# Altium schematic sheet Connectors.SchDoc: Extension connectors
size A4; DocumentNumber: MB1136; Revision: C.3; SheetNumber: 5; SheetTotal: 5; Project: NUCLEO-XXXXRX
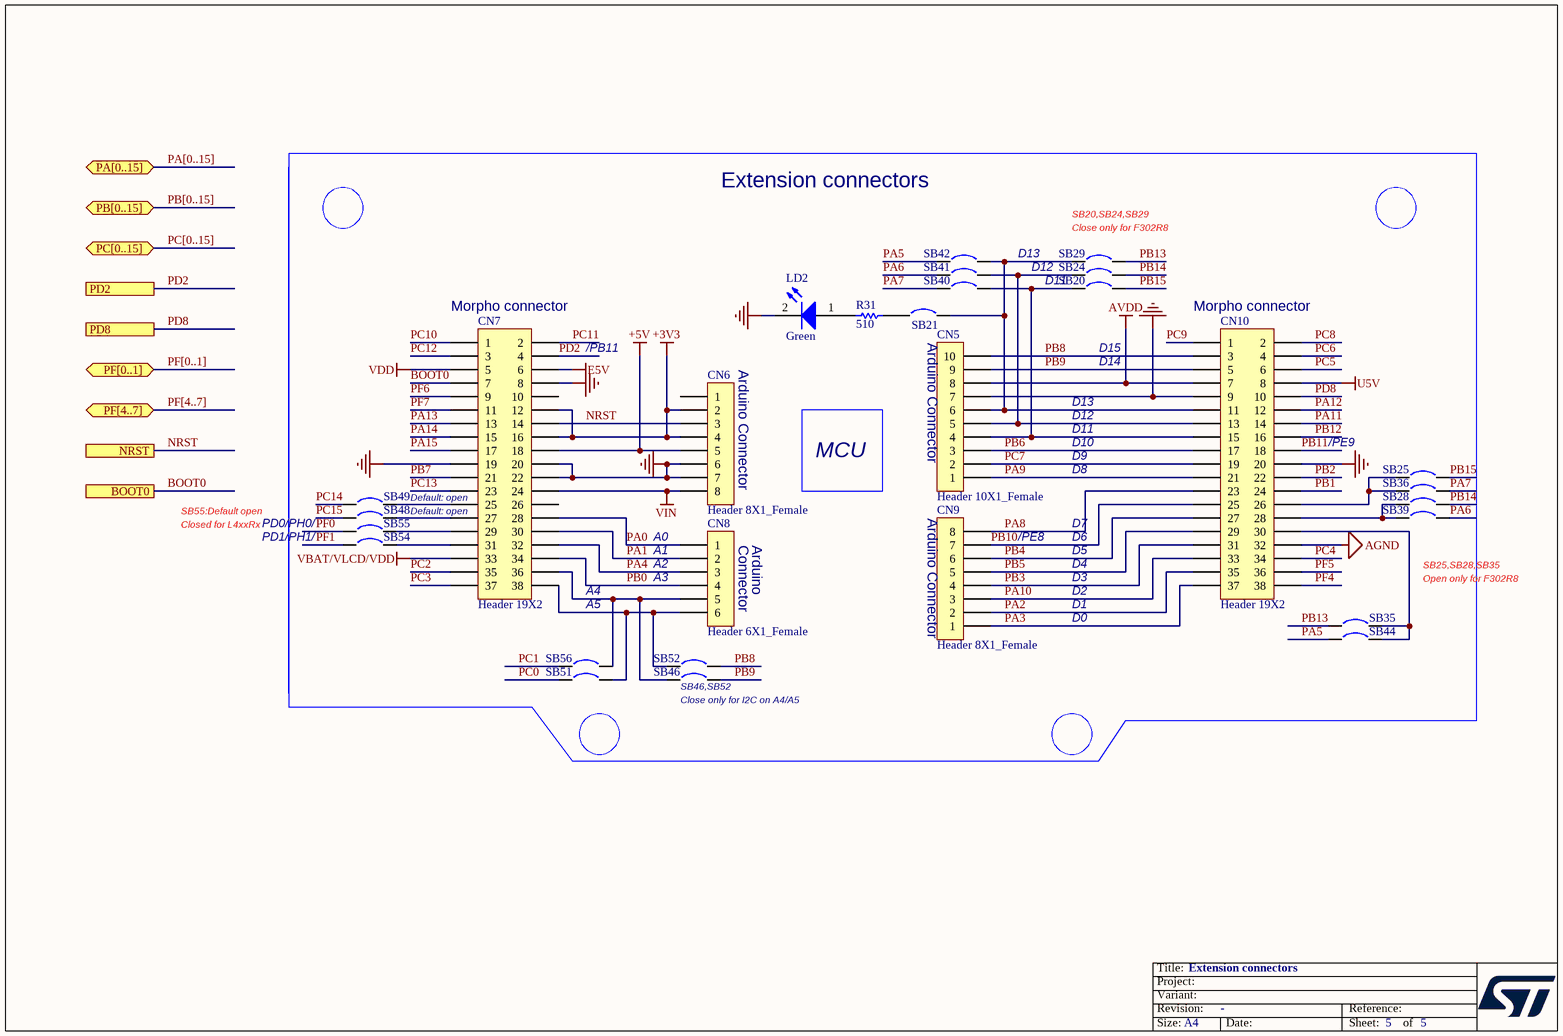
[diagram p0: Connectors.SchDoc]

## Parts
CN5  Header 10X1_Female  [1*10P_FEMALE]
CN6  Header 8X1_Female  [1*8P_FEMALE]
CN7  Header 19X2  [2*19P]
CN8  Header 6X1_Female  [1*6P_FEMALE]
CN9  Header 8X1_Female  [1*8P_FEMALE]
CN10  Header 19X2  [2*19P]
LD2  Green  [0603D]
R31  510  [0603R]
SB20  Circuit Breaker  [JP2_SMD]  (value not drawn)
SB21  Circuit Breaker  [JP2_SMD]  (value not drawn)
SB24  Circuit Breaker  [JP2_SMD]  (value not drawn)
SB25  Circuit Breaker  [JP2_SMD]  (value not drawn)
SB28  Circuit Breaker  [JP2_SMD]  (value not drawn)
SB29  Circuit Breaker  [JP2_SMD]  (value not drawn)
SB35  Circuit Breaker  [JP2_SMD]  (value not drawn)
SB36  Circuit Breaker  [JP2_SMD]  (value not drawn)
SB39  Circuit Breaker  [JP2_SMD]  (value not drawn)
SB40  Circuit Breaker  [JP2_SMD]  (value not drawn)
SB41  Circuit Breaker  [JP2_SMD]  (value not drawn)
SB42  Circuit Breaker  [JP2_SMD]  (value not drawn)
SB44  Circuit Breaker  [JP2_SMD]  (value not drawn)
SB46  Circuit Breaker  [JP2_SMD]  (value not drawn)
SB48  Circuit Breaker  [JP2_SMD]  (value not drawn)
SB49  Circuit Breaker  [JP2_SMD]  (value not drawn)
SB51  Circuit Breaker  [JP2_SMD]  (value not drawn)
SB52  Circuit Breaker  [JP2_SMD]  (value not drawn)
SB54  Circuit Breaker  [JP2_SMD]  (value not drawn)
SB55  Circuit Breaker  [JP2_SMD]  (value not drawn)
SB56  Circuit Breaker  [JP2_SMD]  (value not drawn)

## Ports
BOOT0, NRST, PA[0..15] (bidir), PB[0..15] (bidir), PC[0..15] (bidir), PD2, PD8, PF[0..1] (bidir), PF[4..7] (bidir)

## Nets
+3V3: CN6.2 CN6.4 CN7.12 CN7.16
+5V: CN6.5 CN7.18
AGND: CN10.32
AVDD: CN5.8 CN10.7
E5V: CN7.6
GND: CN5.7 CN6.6 CN6.7 CN7.8 CN7.19 CN7.20 CN7.22 CN10.9 CN10.20 LD2.2(K)
U5V: CN10.8
VBAT/VLCD/VDD: CN7.33
VDD: CN7.5
VIN: CN6.8 CN7.24
BOOT0: CN7.7 ; port BOOT0
NRST: CN6.3 CN7.14 ; port NRST
PA0: CN7.28 CN8.1
PA1: CN7.30 CN8.2
PA2: CN9.2 CN10.35
PA3: CN9.1 CN10.37
PA4: CN7.32 CN8.3
PA5: SB42.1 SB44.2
PA6: SB39.1 SB41.1
PA7: SB36.1 SB40.1
PA8: CN9.8 CN10.23
PA9: CN5.1 CN10.21
PA10: CN9.3 CN10.33
PA11: CN10.14
PA12: CN10.12
PA13: CN7.13
PA14: CN7.15
PA15: CN7.17
PB0: CN7.34 CN8.4
PB1: CN10.24
PB2: CN10.22
PB3: CN9.4 CN10.31
PB4: CN9.6 CN10.27
PB5: CN9.5 CN10.29
PB6: CN5.3 CN10.17
PB7: CN7.21
PB8: CN5.10 CN10.3 SB52.2
PB9: CN5.9 CN10.5 SB46.2
PB10: CN9.7 CN10.25
PB11: CN10.18
PB12: CN10.16
PB13: SB29.2 SB35.2
PB14: SB24.2 SB28.1
PB15: SB20.2 SB25.1
PC0: SB51.1
PC1: SB56.1
PC2: CN7.35
PC3: CN7.37
PC4: CN10.34
PC5: CN10.6
PC6: CN10.4
PC7: CN5.2 CN10.19
PC8: CN10.2
PC9: CN10.1
PC10: CN7.1
PC11: CN7.2
PC12: CN7.3
PC13: CN7.23
PC14: SB49.2
PC15: SB48.2
PD2: CN7.4 ; port PD2
PD8: CN10.10 ; port PD8
PF0: SB55.2
PF1: SB54.2
PF4: CN10.38
PF5: CN10.36
PF6: CN7.9
PF7: CN7.11
NetCN5_4: CN5.4 CN10.15 SB20.1 SB40.2
NetCN5_5: CN5.5 CN10.13 SB24.1 SB41.2
NetCN5_6: CN5.6 CN10.11 SB21.2 SB29.1 SB42.2
NetCN7_25: CN7.25 SB49.1
NetCN7_27: CN7.27 SB48.1
NetCN7_29: CN7.29 SB55.1
NetCN7_31: CN7.31 SB54.1
NetCN7_36: CN7.36 CN8.5 SB46.1 SB56.2
NetCN7_38: CN7.38 CN8.6 SB51.2 SB52.1
NetCN10_26: CN10.26 SB25.2 SB36.2
NetCN10_28: CN10.28 SB28.2 SB39.2
NetCN10_30: CN10.30 SB35.1 SB44.1
NetLD2_1: LD2.1(A) R31.2
NetR31_1: R31.1 SB21.1

Not connected (* = marked no-connect by the designer): CN6 1; CN7 10 26

## Buses and harness runs
bus PA[0..15] = port PA[0..15]
bus PB[0..15] = port PB[0..15]
bus PC[0..15] = port PC[0..15]
bus PF[0..1] = port PF[0..1]
bus PF[4..7] = port PF[4..7]

## Notes on the sheet
- Extension connectors
- Close only for F302R8
- SB20,SB24,SB29
- (near CN7) Morpho connector
- D13
- D12
- D11
- (near CN10) Morpho connector
- /PB11
- (near CN6) Arduino Connector
- Arduino Connector
- D14
- D15
- D10
- /PE9
- SB55:Default open
- (near CN7) Default: open
- MCU
- (near CN9) Arduino Connector
- D8
- D9
- Closed for L4xxRx
- PD0/PH0/
- PD1/PH1/
- A0
- (near CN8) A1
- (near CN8) A2
- (near CN8) A3
- (near CN8) Connector
- (near CN8) Arduino
- /PE8
- D4
- D3
- D5
- D6
- D7
- Open only for F302R8
- SB25,SB28,SB35
- A4
- A5
- D0
- D1
- D2
- (near SB46) Close only for I2C on A4/A5
- (near SB46) SB46,SB52
- Title:
- Project:
- Size:
- Revision:
- Variant:
- -
- Date:
- Reference:
- Sheet:
- of

## Library data of the parts
CN5 = Header 10X1_Female: Header, 10-Pin, Single row,female; LatestRevisionDate: 17-Jul-2002; LatestRevisionNote: Re-released for DXP Platform.; Publisher: Altium Limited
CN6 CN9 = Header 8X1_Female: Header, 8-Pin, Single row,female; LatestRevisionDate: 17-Jul-2002; LatestRevisionNote: Re-released for DXP Platform.; Publisher: Altium Limited
CN7 CN10 = Header 19X2: Header, 19-Pin, Dual row; Revision: 17-Jul-2002: Re-released for DXP Platform.; Publisher: Altium Limited
CN8 = Header 6X1_Female: Header, 6-Pin, Single row,female; LatestRevisionDate: 17-Jul-2002; LatestRevisionNote: Re-released for DXP Platform.; Publisher: Altium Limited
LD2 = LED2: Typical RED, GREEN, YELLOW, AMBER GaAs LED; Published: 8-Jun-2000; Revision: July-2002: Re-released for DXP Platform.; Publisher: Altium Limited
R31 = Res1: Resistor; Value: 1K; Published: 8-Jun-2000; Revision: July-2002: Re-released for DXP Platform.; Publisher: Altium Limited
SB20 SB21 SB24 SB25 SB28 SB29 SB35 SB36 SB39-SB42 SB44 SB46 SB48 SB49 SB51 SB52 SB54-SB56 = Circuit Breaker: Solder: NO; Published: 24-Mar-1999; Revision: July-2002: Re-released for DXP Platform.; Publisher: Altium Limited